# Altium schematic sheet Sensorboard_Schematic.schdoc
size 309 x 216 mm
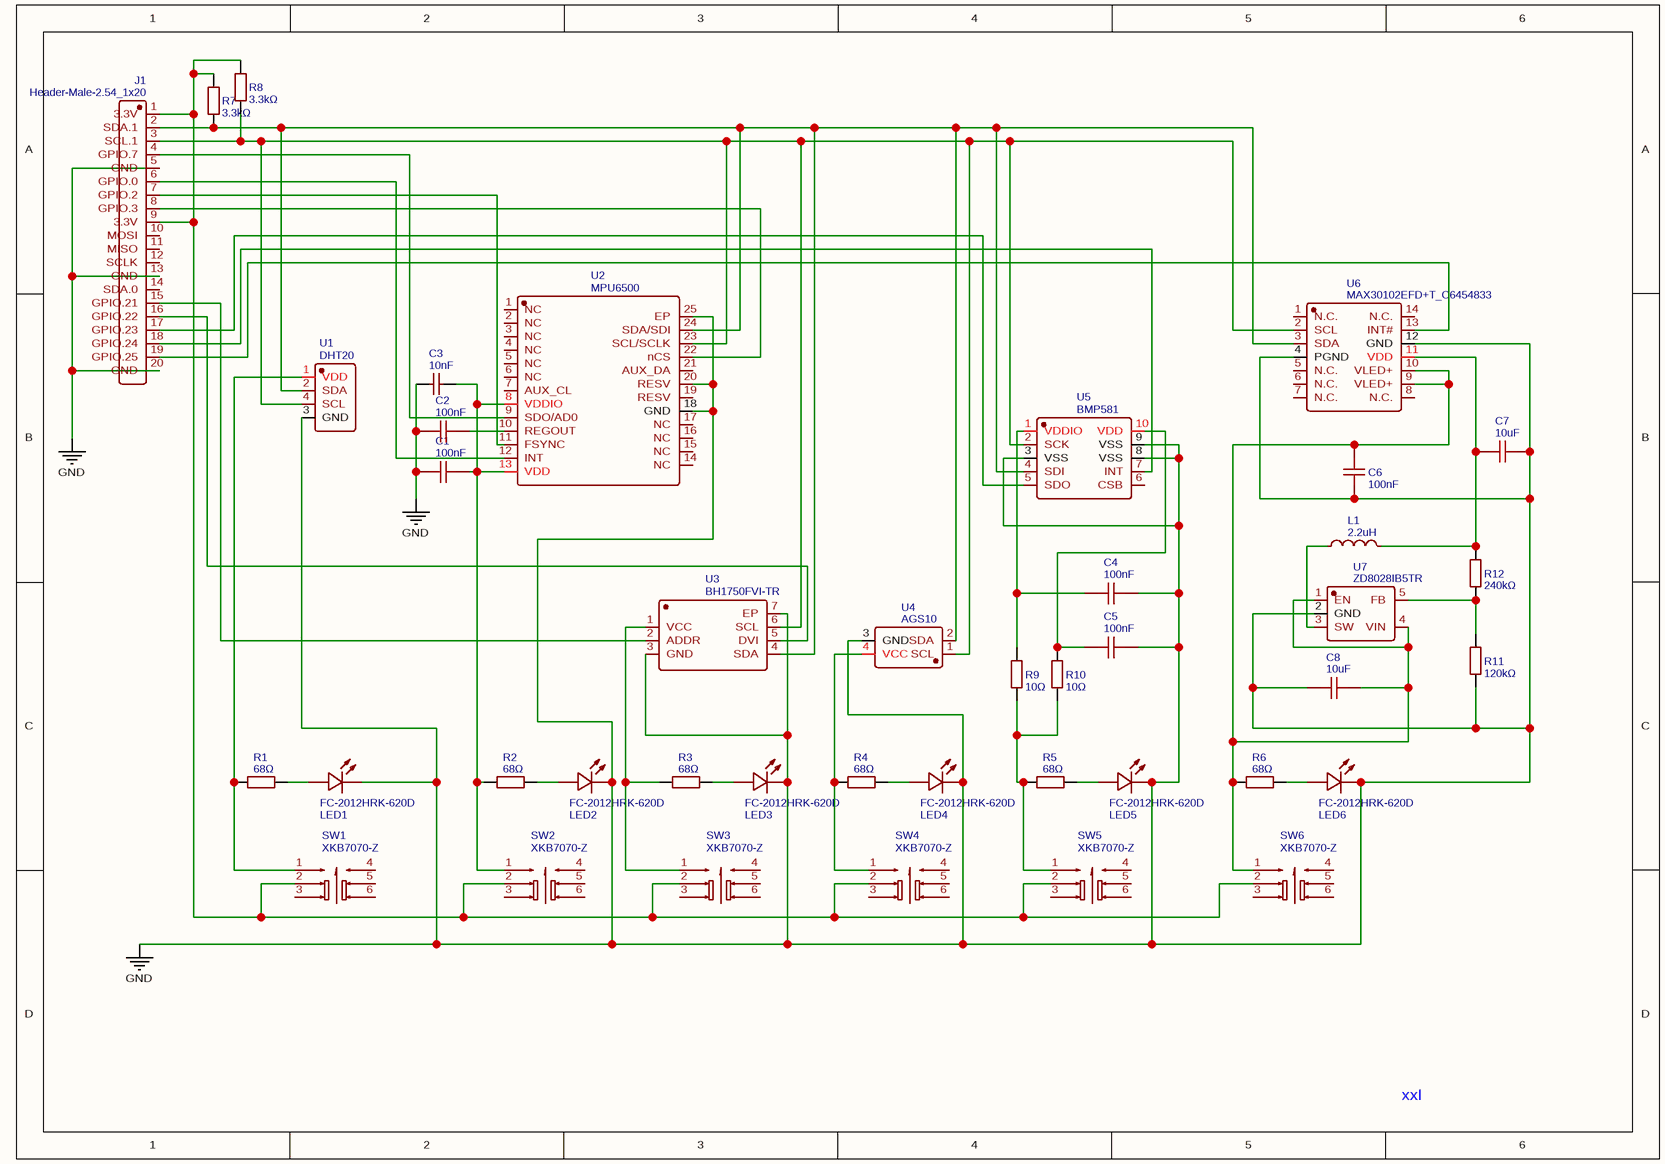
[diagram p0: Sensorboard_Schematic.schdoc]

## Parts
C1  100nF  [C0603]
C2  100nF  [C0603]
C3  10nF  [C0603]
C4  100nF  [C0603]
C5  100nF  [C0603]
C6  100nF  [C0603]
C7  10uF  [C0805]
C8  10uF  [C0805]
J1  Header-Male-2.54_1x20  [HDR-TH_20P-P2.54-V-M-1]
L1  2.2uH  [L0805]
LED1  FC-2012HRK-620D  [LED0805-R-RD]
LED2  FC-2012HRK-620D  [LED0805-R-RD]
LED3  FC-2012HRK-620D  [LED0805-R-RD]
LED4  FC-2012HRK-620D  [LED0805-R-RD]
LED5  FC-2012HRK-620D  [LED0805-R-RD]
LED6  FC-2012HRK-620D  [LED0805-R-RD]
R1  68Ω  [R0805]
R2  68Ω  [R0805]
R3  68Ω  [R0805]
R4  68Ω  [R0805]
R5  68Ω  [R0805]
R6  68Ω  [R0805]
R7  3.3kΩ  [R0603]
R8  3.3kΩ  [R0603]
R9  10Ω  [R0603]
R10  10Ω  [R0603]
R11  120kΩ  [R0603]
R12  240kΩ  [R0603]
SW1  XKB7070-Z  [SW-TH_6P-L7.0-W7.0-P2.00]
SW2  XKB7070-Z  [SW-TH_6P-L7.0-W7.0-P2.00]
SW3  XKB7070-Z  [SW-TH_6P-L7.0-W7.0-P2.00]
SW4  XKB7070-Z  [SW-TH_6P-L7.0-W7.0-P2.00]
SW5  XKB7070-Z  [SW-TH_6P-L7.0-W7.0-P2.00]
SW6  XKB7070-Z  [SW-TH_6P-L7.0-W7.0-P2.00]
U1  DHT20  [SENSOR-TH_DHT20]
U2  MPU6500  [QFN-24_L3.0-W3.0-P0.40-BL-EP]
U3  BH1750FVI-TR  [WSOF-6_L2.6-W1.6-P0.50-TL-EP]
U4  AGS10  [SENSOR-SMD_AGS10]
U5  BMP581  [LGA-10_L2.0-W2.0-P0.50-TL_BMP581]
U6  MAX30102EFD+T_C6454833  [OESIP-14_L5.6-W3.3-P0.80-TL]
U7  ZD8028IB5TR  [SOT-23-5_L2.9-W1.6-P0.95-LS2.9-BL]

## Nets
GND: C1.1 C2.1 C3.1 C4.2 C5.2 C6.2 C7.2 C8.1 J1.5(GND) J1.13(GND) J1.20(GND) LED1.2(-) LED2.2(-) LED3.2(-) LED4.2(-) LED5.2(-) LED6.2(-) R11.1 U1.3(GND) U2.18(GND) U2.20(RESV) U2.25(EP) U3.3(GND) U3.7(EP) U4.3(GND) U5.3(VSS) U5.8(VSS) U5.9(VSS) U6.4(PGND) U6.12(GND) U7.2(GND)
NetC1_2: C1.2 C3.2 R2.1 SW2.1 U2.8(VDDIO) U2.13(VDD)
NetC2_2: C2.2 U2.10(REGOUT)
NetC4_1: C4.1 R9.2 U5.1(VDDIO)
NetC5_1: C5.1 R10.1 U5.10(VDD)
NetC6_1: C6.1 C8.2 R6.1 SW6.1 U6.9(VLED+) U6.10(VLED+) U7.1(EN) U7.4(VIN)
NetC7_1: C7.1 L1.2 R12.2 U6.11(VDD)
NetJ1_1: J1.1(3.3V) J1.9(3.3V) R7.2 R8.1 SW1.2 SW2.2 SW3.2 SW4.2 SW5.2 SW6.2
NetJ1_2: J1.2(SDA.1) R7.1 U1.2(SDA) U2.24(SDA/SDI) U3.4(SDA) U4.2(SDA) U5.4(SDI) U6.3(SDA)
NetJ1_3: J1.3(SCL.1) R8.2 U1.4(SCL) U2.23(SCL/SCLK) U3.6(SCL) U4.1(SCL) U5.2(SCK) U6.2(SCL)
NetJ1_4: J1.4(GPIO.7) U2.9(SDO/AD0)
NetJ1_6: J1.6(GPIO.0) U2.12(INT)
NetJ1_7: J1.7(GPIO.2) U2.11(FSYNC)
NetJ1_8: J1.8(GPIO.3) U2.22(nCS)
NetJ1_15: J1.15(GPIO.21) U3.2(ADDR)
NetJ1_16: J1.16(GPIO.22) U3.5(DVI)
NetJ1_17: J1.17(GPIO.23) U5.5(SDO)
NetJ1_18: J1.18(GPIO.24) U5.7(INT)
NetJ1_19: J1.19(GPIO.25) U6.13(INT#)
NetL1_1: L1.1 U7.3(SW)
NetLED1_1: LED1.1(+) R1.2
NetLED2_1: LED2.1(+) R2.2
NetLED3_1: LED3.1(+) R3.2
NetLED4_1: LED4.1(+) R4.2
NetLED5_1: LED5.1(+) R5.2
NetLED6_1: LED6.1(+) R6.2
NetR1_1: R1.1 SW1.1 U1.1(VDD)
NetR3_1: R3.1 SW3.1 U3.1(VCC)
NetR4_1: R4.1 SW4.1 U4.4(VCC)
NetR5_1: R5.1 R9.1 R10.2 SW5.1
NetR11_2: R11.2 R12.1 U7.5(FB)

Not connected (* = marked no-connect by the designer): J1 10(MOSI) 11(MISO) 12(SCLK) 14(SDA.0); SW1 3 4 5 6; SW2 3 4 5 6; SW3 3 4 5 6; SW4 3 4 5 6; SW5 3 4 5 6; SW6 3 4 5 6; U2 1(NC) 2(NC) 3(NC) 4(NC) 5(NC) 6(NC) 7(AUX_CL) 14(NC) 15(NC) 16(NC) 17(NC) 19(RESV) 21(AUX_DA); U5 6(CSB); U6 1(N.C.) 5(N.C.) 6(N.C.) 7(N.C.) 8(N.C.) 14(N.C.)

## Notes on the sheet
- xxl

## Library data of the parts
C1 C2 C4-C6 = 100nF: Manufacturer: YAGEO(国巨); Manufacturer Part: CC0603KRX7R9BB104; nameAlias: Value; Supplier: LCSC; Supplier Part: C14663; JLCPCB Part Class: Basic Part; spicePre: C; spiceSymbolName: CC0603KRX7R9BB104
C3 = 10nF: Manufacturer: YAGEO(国巨); Manufacturer Part: CC0603KRX7R9BB103; nameAlias: Value; Supplier: LCSC; Supplier Part: C100042; JLCPCB Part Class: Extended Part; spicePre: C; spiceSymbolName: CC0603KRX7R9BB103
C7 C8 = 10uF: Manufacturer Part: CL21A106KAYNNNE; Manufacturer: SAMSUNG(三星); nameAlias: Value; Supplier: LCSC; Supplier Part: C15850; JLCPCB Part Class: Basic Part; spicePre: C; spiceSymbolName: CL21A106KAYNNNE
J1 = Header-Male-2.54_1x20: Manufacturer: BOOMELE(博穆精密); Manufacturer Part: 2.54-1*20P直针; Supplier: LCSC; Supplier Part: C50981; JLCPCB Part Class: Extended Part; spicePre: J; spiceSymbolName: Header-Male-2.54_1x20
L1 = 2.2uH: Manufacturer Part: CMI201209U2R2KT; Manufacturer: FH(风华); nameAlias: Value; Supplier: LCSC; Supplier Part: C1043; JLCPCB Part Class: Extended Part; spicePre: L; spiceSymbolName: CMI201209U2R2KT
LED1-LED6 = FC-2012HRK-620D: Manufacturer: 国星光电; Manufacturer Part: NCD0805R1; Supplier: LCSC; Supplier Part: C84256; JLCPCB Part Class: Basic Part; link: https://so.szlcsc.com/global.html?k=C84256&ref=editor; spicePre: L; spiceSymbolName: FC-2012HRK-620D
R1-R6 = 68Ω: Manufacturer: UNI-ROYAL(厚声); Manufacturer Part: 0805W8F680JT5E; nameAlias: Value; Supplier: LCSC; Supplier Part: C17802; JLCPCB Part Class: Extended Part; spicePre: R; spiceSymbolName: 0805W8F680JT5E
R7 R8 = 3.3kΩ: Manufacturer: UNI-ROYAL(厚声); Manufacturer Part: 0603WAF3301T5E; nameAlias: Value; Supplier: LCSC; Supplier Part: C22978; JLCPCB Part Class: Basic Part; spicePre: R; spiceSymbolName: 0603WAF3301T5E
R9 R10 = 10Ω: Manufacturer: UNI-ROYAL(厚声); Manufacturer Part: 0603WAF100JT5E; nameAlias: Value; Supplier: LCSC; Supplier Part: C22859; JLCPCB Part Class: Basic Part; spicePre: R; spiceSymbolName: 0603WAF100JT5E
R11 = 120kΩ: Manufacturer: UNI-ROYAL(厚声); Manufacturer Part: 0603WAF1203T5E; nameAlias: Value; Supplier: LCSC; Supplier Part: C25808; JLCPCB Part Class: Basic Part; spicePre: R; spiceSymbolName: 0603WAF1203T5E
R12 = 240kΩ: Manufacturer: UNI-ROYAL(厚声); Manufacturer Part: 0603WAF2403T5E; nameAlias: Value; Supplier: LCSC; Supplier Part: C4197; JLCPCB Part Class: Extended Part; spicePre: R; spiceSymbolName: 0603WAF2403T5E
SW1-SW6 = XKB7070-Z: Manufacturer: XKB Connectivity(中国星坤); Contributor: LCSC; Supplier: LCSC; Supplier Part: C318863; Manufacturer Part: XKB7070-Z; JLCPCB Part Class: Extended Part; spicePre: S; spiceSymbolName: XKB7070-Z
U1 = DHT20: Manufacturer: 广州奥松; Contributor: lcsc; Supplier: LCSC; Supplier Part: C3012627; Manufacturer Part: DHT20; JLCPCB Part Class: Extended Part; spicePre: U; spiceSymbolName: DHT20
U2 = MPU6500: Manufacturer: TDK InvenSense(应美盛); Supplier: LCSC; Manufacturer Part: MPU-6500; Supplier Part: C50278; JLCPCB Part Class: Extended Part; spicePre: U; spiceSymbolName: MPU6500
U3 = BH1750FVI-TR: Manufacturer: ROHM(罗姆); Supplier: LCSC; Manufacturer Part: BH1750FVI-TR; Supplier Part: C78960; JLCPCB Part Class: Extended Part; spicePre: U; spiceSymbolName: BH1750FVI-TR
U4 = AGS10: Manufacturer: 广州奥松; Contributor: lcsc; Supplier: LCSC; Supplier Part: C3012632; Manufacturer Part: AGS10; JLCPCB Part Class: Extended Part; spicePre: U; spiceSymbolName: AGS10
U5 = BMP581: Manufacturer: Bosch(博世); Contributor: lcsc; Supplier: LCSC; Supplier Part: C5362283; Manufacturer Part: BMP581; JLCPCB Part Class: Extended Part; spicePre: U; spiceSymbolName: BMP581
U6 = MAX30102EFD+T_C6454833: Manufacturer: ADI(亚德诺)/MAXIM(美信); Supplier: LCSC; Supplier Part: C6454833; Manufacturer Part: MAX30102EFD+T; JLCPCB Part Class: Extended Part; spicePre: U; spiceSymbolName: MAX30102EFD+T_C6454833
U7 = ZD8028IB5TR: Manufacturer: Zetta(澜智); Contributor: lcsc; Supplier: LCSC; Supplier Part: C2928932; Manufacturer Part: ZD8028IB5TR; JLCPCB Part Class: Extended Part; spicePre: U; spiceSymbolName: ZD8028IB5TR